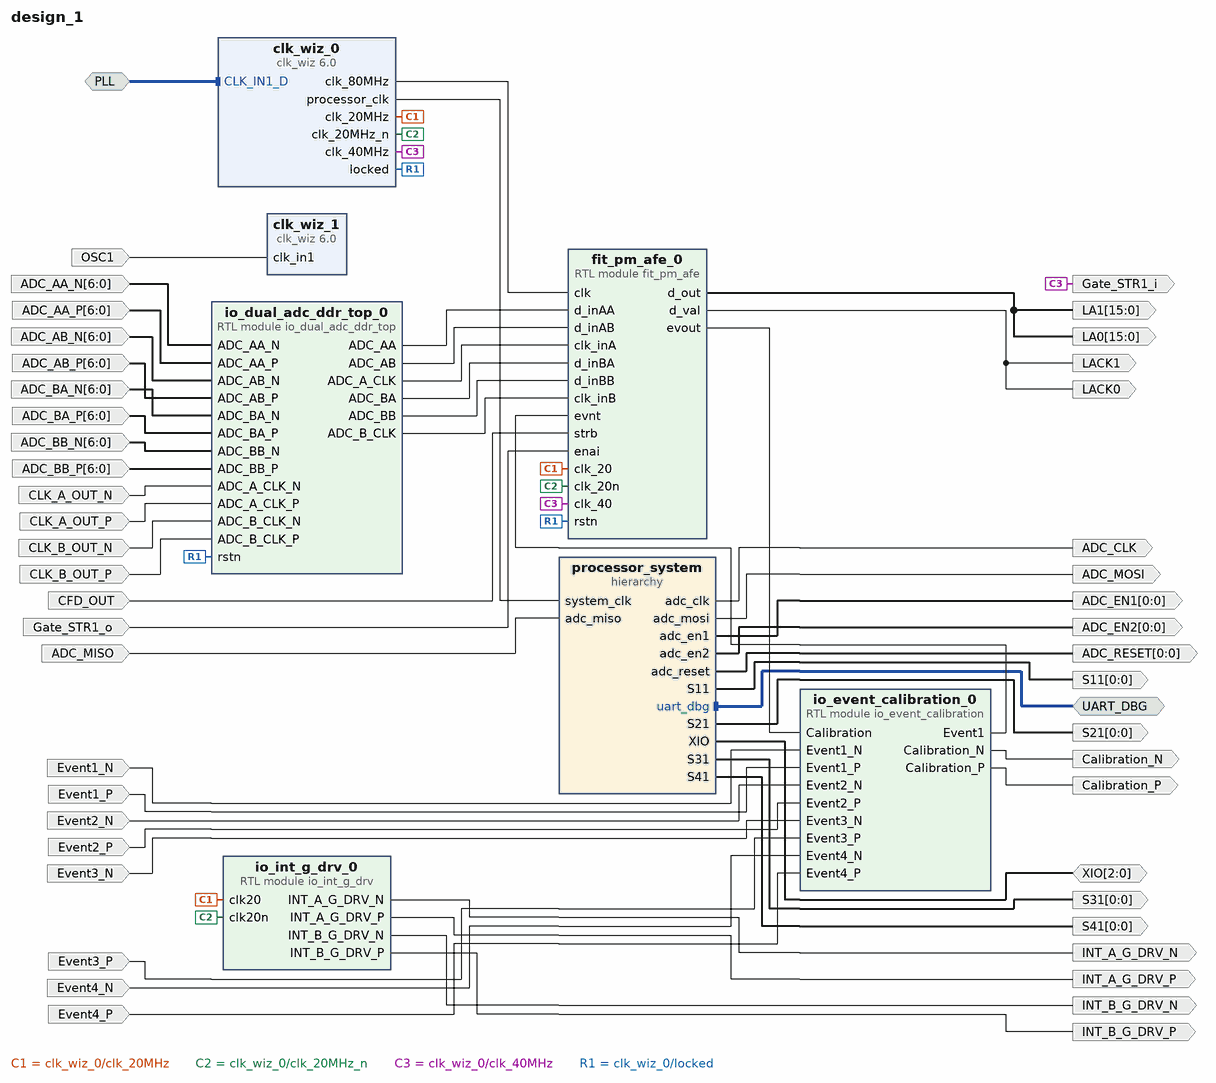
[diagram p0: block diagram of the top level]
# Vivado block design design_1, xcau10p-ffvb676-2-i, Vivado 2024.2
create_bd_design design_1

create_bd_intf_port -mode Master -vlnv xilinx.com:interface:uart_rtl:1.0 UART_DBG
create_bd_intf_port -mode Slave -vlnv xilinx.com:interface:diff_clock_rtl:1.0 PLL
create_bd_port -dir O -from 0 -to 0 S11
create_bd_port -dir O -from 0 -to 0 S21
create_bd_port -dir O -from 0 -to 0 S31
create_bd_port -dir O -from 0 -to 0 S41
create_bd_port -dir IO -from 2 -to 0 XIO
create_bd_port -dir O -from 0 -to 0 ADC_EN1
create_bd_port -dir O -from 0 -to 0 ADC_EN2
create_bd_port -dir O -from 0 -to 0 ADC_RESET
create_bd_port -dir O ADC_CLK
create_bd_port -dir O ADC_MOSI
create_bd_port -dir I ADC_MISO
create_bd_port -dir O Gate_STR1_i
create_bd_port -dir I Gate_STR1_o
create_bd_port -dir I -type clk CLK_A_OUT_N
set_property -dict {CONFIG.FREQ_HZ 240000000} [get_bd_ports CLK_A_OUT_N]
create_bd_port -dir I -type clk CLK_A_OUT_P
set_property -dict {CONFIG.FREQ_HZ 240000000} [get_bd_ports CLK_A_OUT_P]
create_bd_port -dir I -type clk CLK_B_OUT_N
set_property -dict {CONFIG.FREQ_HZ 240000000} [get_bd_ports CLK_B_OUT_N]
create_bd_port -dir I -type clk CLK_B_OUT_P
set_property -dict {CONFIG.FREQ_HZ 240000000} [get_bd_ports CLK_B_OUT_P]
create_bd_port -dir I Event1_N
create_bd_port -dir I Event1_P
create_bd_port -dir I Event2_N
create_bd_port -dir I Event2_P
create_bd_port -dir I Event3_N
create_bd_port -dir I Event3_P
create_bd_port -dir I Event4_N
create_bd_port -dir I Event4_P
create_bd_port -dir O Calibration_P
create_bd_port -dir O Calibration_N
create_bd_port -dir I CFD_OUT
create_bd_port -dir I OSC1
create_bd_port -dir O INT_A_G_DRV_N
create_bd_port -dir O INT_A_G_DRV_P
create_bd_port -dir O INT_B_G_DRV_N
create_bd_port -dir O INT_B_G_DRV_P
create_bd_port -dir O -from 15 -to 0 LA0
create_bd_port -dir O LACK0
create_bd_port -dir O LACK1
create_bd_port -dir O -from 15 -to 0 LA1
create_bd_port -dir I -from 6 -to 0 ADC_AA_N
create_bd_port -dir I -from 6 -to 0 ADC_AA_P
create_bd_port -dir I -from 6 -to 0 ADC_AB_N
create_bd_port -dir I -from 6 -to 0 ADC_AB_P
create_bd_port -dir I -from 6 -to 0 ADC_BA_N
create_bd_port -dir I -from 6 -to 0 ADC_BA_P
create_bd_port -dir I -from 6 -to 0 ADC_BB_N
create_bd_port -dir I -from 6 -to 0 ADC_BB_P

create_bd_cell -type hier processor_system
create_bd_cell -type ip -vlnv xilinx.com:ip:clk_wiz:6.0 clk_wiz_0
set_property -dict [list \
  CONFIG.CLKOUT2_JITTER 139.033 \
  CONFIG.CLKOUT2_PHASE_ERROR 87.180 \
  CONFIG.CLKOUT2_REQUESTED_OUT_FREQ 40.000 \
  CONFIG.CLKOUT2_USED true \
  CONFIG.CLKOUT3_JITTER 162.167 \
  CONFIG.CLKOUT3_PHASE_ERROR 87.180 \
  CONFIG.CLKOUT3_REQUESTED_OUT_FREQ 20.000 \
  CONFIG.CLKOUT3_USED true \
  CONFIG.CLKOUT4_JITTER 162.167 \
  CONFIG.CLKOUT4_PHASE_ERROR 87.180 \
  CONFIG.CLKOUT4_REQUESTED_OUT_FREQ 20.000 \
  CONFIG.CLKOUT4_REQUESTED_PHASE 180.000 \
  CONFIG.CLKOUT4_USED true \
  CONFIG.CLKOUT5_JITTER 120.663 \
  CONFIG.CLKOUT5_PHASE_ERROR 87.180 \
  CONFIG.CLKOUT5_REQUESTED_OUT_FREQ 80.000 \
  CONFIG.CLKOUT5_USED true \
  CONFIG.CLK_OUT1_PORT processor_clk \
  CONFIG.CLK_OUT2_PORT clk_40MHz \
  CONFIG.CLK_OUT3_PORT clk_20MHz \
  CONFIG.CLK_OUT4_PORT clk_20MHz_n \
  CONFIG.CLK_OUT5_PORT clk_80MHz \
  CONFIG.MMCM_CLKIN2_PERIOD 15.000 \
  CONFIG.MMCM_CLKOUT1_DIVIDE 30 \
  CONFIG.MMCM_CLKOUT2_DIVIDE 60 \
  CONFIG.MMCM_CLKOUT3_DIVIDE 60 \
  CONFIG.MMCM_CLKOUT3_PHASE 180.000 \
  CONFIG.MMCM_CLKOUT4_DIVIDE 15 \
  CONFIG.NUM_OUT_CLKS 5 \
  CONFIG.PRIM_SOURCE Differential_clock_capable_pin \
  CONFIG.USE_RESET false \
] [get_bd_cells clk_wiz_0]
create_bd_cell -type module -reference io_event_calibration io_event_calibration_0
create_bd_cell -type module -reference fit_pm_afe fit_pm_afe_0
create_bd_cell -type ip -vlnv xilinx.com:ip:clk_wiz:6.0 clk_wiz_1
set_property -dict [list \
  CONFIG.CLKIN1_JITTER_PS 400.0 \
  CONFIG.CLKOUT1_JITTER 190.517 \
  CONFIG.CLKOUT1_PHASE_ERROR 222.305 \
  CONFIG.CLKOUT1_USED true \
  CONFIG.MMCM_CLKFBOUT_MULT_F 48.000 \
  CONFIG.MMCM_CLKIN1_PERIOD 40.000 \
  CONFIG.MMCM_CLKIN2_PERIOD 10.0 \
  CONFIG.PRIM_IN_FREQ 25.000 \
  CONFIG.USE_LOCKED false \
  CONFIG.USE_RESET false \
] [get_bd_cells clk_wiz_1]
create_bd_cell -type module -reference io_int_g_drv io_int_g_drv_0
create_bd_cell -type module -reference io_dual_adc_ddr_top io_dual_adc_ddr_top_0

# ---- hierarchy /processor_system ----
current_bd_instance /processor_system
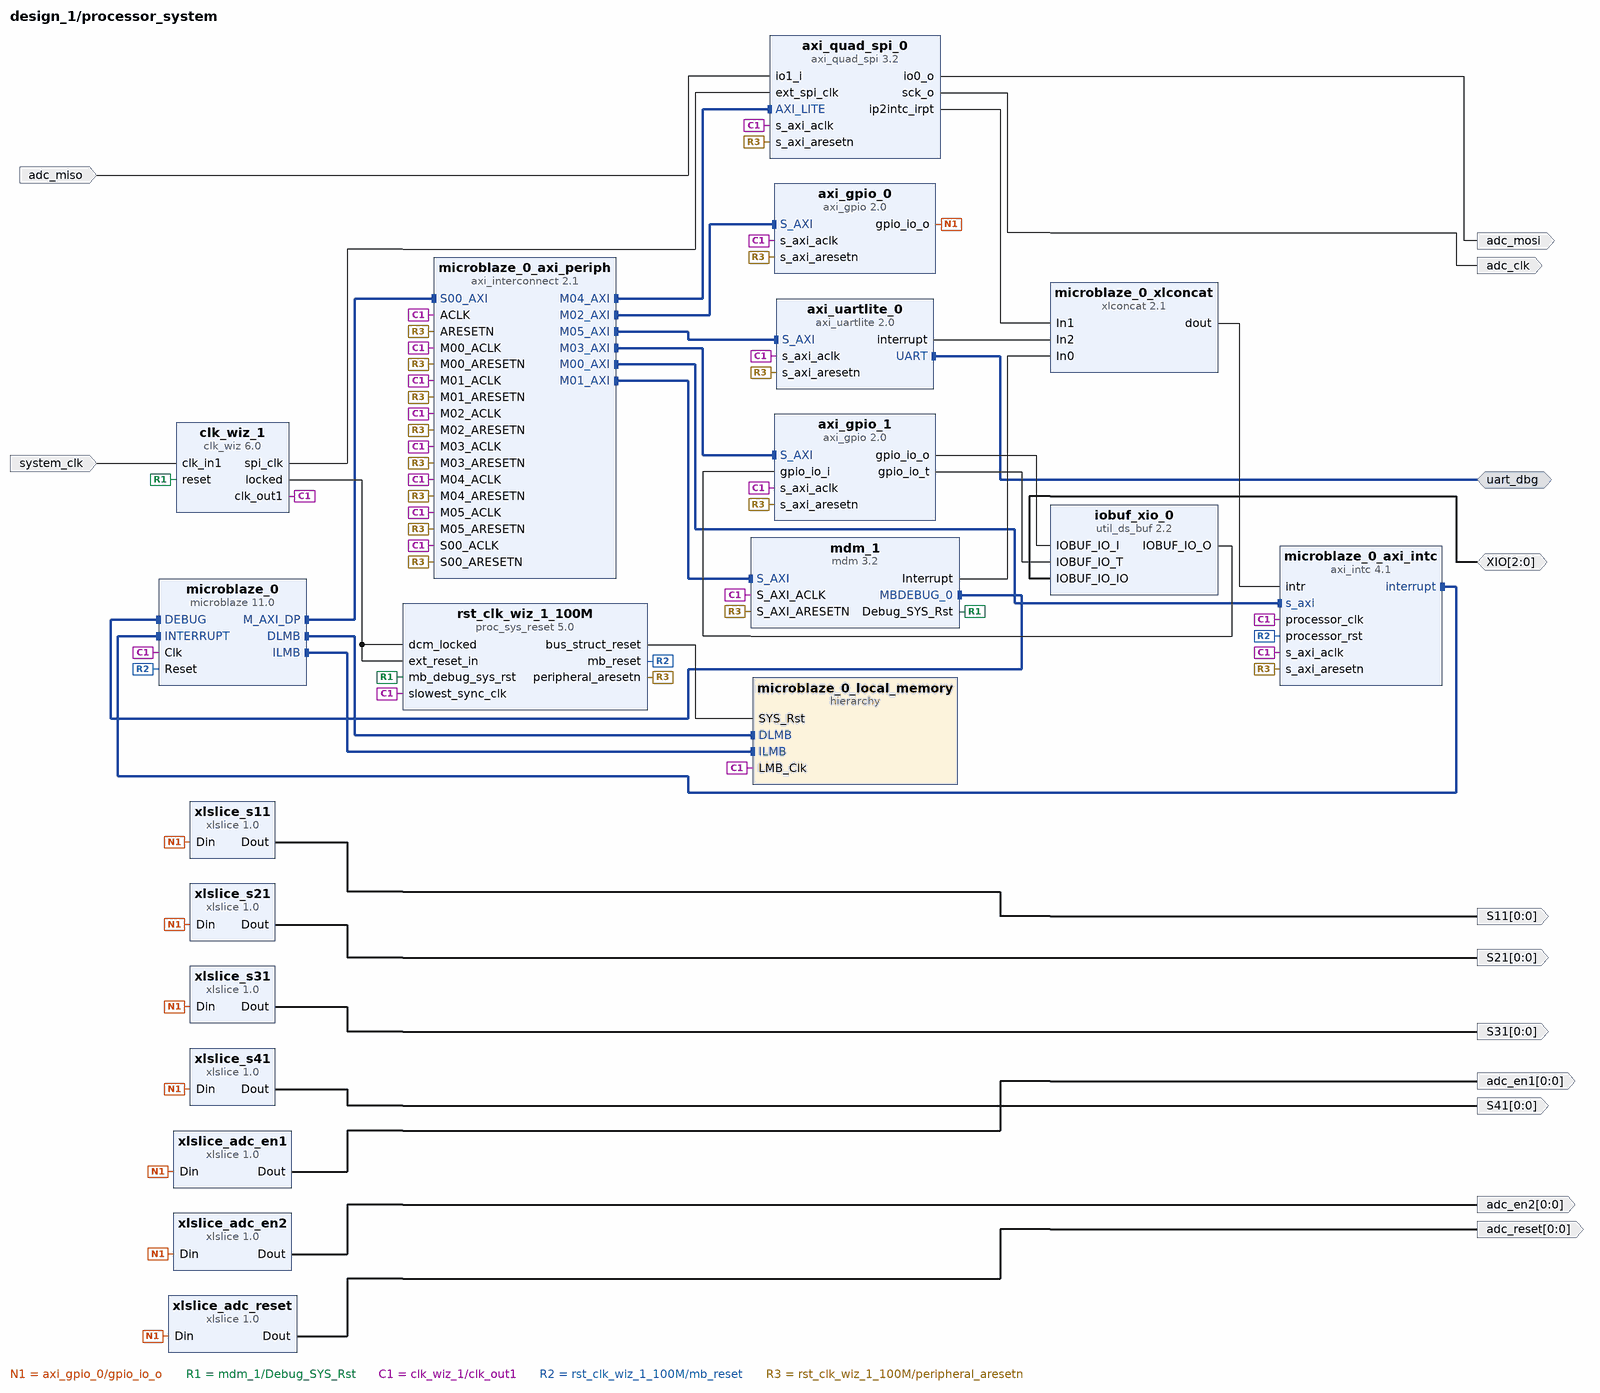
[diagram p1: block diagram inside /processor_system]
create_bd_intf_pin -mode Master -vlnv xilinx.com:interface:uart_rtl:1.0 uart_dbg
create_bd_pin -dir O -from 0 -to 0 S31
create_bd_pin -dir I system_clk
create_bd_pin -dir O adc_mosi
create_bd_pin -dir I adc_miso
create_bd_pin -dir O adc_clk
create_bd_pin -dir O -from 0 -to 0 S41
create_bd_pin -dir O -from 0 -to 0 S11
create_bd_pin -dir O -from 0 -to 0 adc_reset
create_bd_pin -dir O -from 0 -to 0 adc_en1
create_bd_pin -dir IO -from 2 -to 0 XIO
create_bd_pin -dir O -from 0 -to 0 adc_en2
create_bd_pin -dir O -from 0 -to 0 S21

create_bd_cell -type ip -vlnv xilinx.com:ip:xlslice:1.0 xlslice_s31
set_property -dict {CONFIG.DIN_FROM 2 CONFIG.DIN_TO 2 CONFIG.DIN_WIDTH 7} [get_bd_cells xlslice_s31]
create_bd_cell -type ip -vlnv xilinx.com:ip:clk_wiz:6.0 clk_wiz_1
set_property -dict [list \
  CONFIG.CLKOUT2_JITTER 188.586 \
  CONFIG.CLKOUT2_PHASE_ERROR 87.180 \
  CONFIG.CLKOUT2_REQUESTED_OUT_FREQ 10.000 \
  CONFIG.CLKOUT2_USED true \
  CONFIG.CLK_OUT2_PORT spi_clk \
  CONFIG.MMCM_CLKOUT1_DIVIDE 120 \
  CONFIG.NUM_OUT_CLKS 2 \
  CONFIG.PRIM_SOURCE Single_ended_clock_capable_pin \
] [get_bd_cells clk_wiz_1]
create_bd_cell -type ip -vlnv xilinx.com:ip:axi_quad_spi:3.2 axi_quad_spi_0
create_bd_cell -type ip -vlnv xilinx.com:ip:mdm:3.2 mdm_1
set_property -dict {CONFIG.C_ADDR_SIZE 32 CONFIG.C_M_AXI_ADDR_WIDTH 32 CONFIG.C_USE_UART 1} [get_bd_cells mdm_1]
create_bd_cell -type ip -vlnv xilinx.com:ip:xlslice:1.0 xlslice_s41
set_property -dict {CONFIG.DIN_FROM 3 CONFIG.DIN_TO 3 CONFIG.DIN_WIDTH 7} [get_bd_cells xlslice_s41]
create_bd_cell -type ip -vlnv xilinx.com:ip:xlslice:1.0 xlslice_s11
set_property -dict {CONFIG.DIN_WIDTH 7} [get_bd_cells xlslice_s11]
create_bd_cell -type ip -vlnv xilinx.com:ip:axi_gpio:2.0 axi_gpio_0
set_property -dict {CONFIG.C_ALL_OUTPUTS 1 CONFIG.C_GPIO_WIDTH 7} [get_bd_cells axi_gpio_0]
create_bd_cell -type ip -vlnv xilinx.com:ip:axi_uartlite:2.0 axi_uartlite_0
create_bd_cell -type ip -vlnv xilinx.com:ip:axi_gpio:2.0 axi_gpio_1
set_property -dict {CONFIG.C_ALL_OUTPUTS 0 CONFIG.C_GPIO_WIDTH 3} [get_bd_cells axi_gpio_1]
create_bd_cell -type ip -vlnv xilinx.com:ip:xlslice:1.0 xlslice_adc_reset
set_property -dict {CONFIG.DIN_FROM 6 CONFIG.DIN_TO 6 CONFIG.DIN_WIDTH 7} [get_bd_cells xlslice_adc_reset]
create_bd_cell -type ip -vlnv xilinx.com:ip:xlslice:1.0 xlslice_adc_en1
set_property -dict {CONFIG.DIN_FROM 4 CONFIG.DIN_TO 4 CONFIG.DIN_WIDTH 7} [get_bd_cells xlslice_adc_en1]
create_bd_cell -type ip -vlnv xilinx.com:ip:util_ds_buf:2.2 iobuf_xio_0
set_property -dict {CONFIG.C_BUF_TYPE IOBUF CONFIG.C_SIZE 3} [get_bd_cells iobuf_xio_0]
create_bd_cell -type ip -vlnv xilinx.com:ip:xlslice:1.0 xlslice_adc_en2
set_property -dict {CONFIG.DIN_FROM 5 CONFIG.DIN_TO 5 CONFIG.DIN_WIDTH 7} [get_bd_cells xlslice_adc_en2]
create_bd_cell -type ip -vlnv xilinx.com:ip:xlslice:1.0 xlslice_s21
set_property -dict {CONFIG.DIN_FROM 1 CONFIG.DIN_TO 1 CONFIG.DIN_WIDTH 7} [get_bd_cells xlslice_s21]
create_bd_cell -type ip -vlnv xilinx.com:ip:proc_sys_reset:5.0 rst_clk_wiz_1_100M
create_bd_cell -type ip -vlnv xilinx.com:ip:microblaze:11.0 microblaze_0
set_property -dict [list \
  CONFIG.C_DEBUG_ENABLED 1 \
  CONFIG.C_D_AXI 1 \
  CONFIG.C_D_LMB 1 \
  CONFIG.C_ENABLE_CONVERSION 0 \
  CONFIG.C_I_LMB 1 \
  CONFIG.G_TEMPLATE_LIST 8 \
] [get_bd_cells microblaze_0]
create_bd_cell -type ip -vlnv xilinx.com:ip:xlconcat:2.1 microblaze_0_xlconcat
set_property -dict {CONFIG.NUM_PORTS 3} [get_bd_cells microblaze_0_xlconcat]
create_bd_cell -type ip -vlnv xilinx.com:ip:axi_intc:4.1 microblaze_0_axi_intc
set_property -dict {CONFIG.C_HAS_FAST 1} [get_bd_cells microblaze_0_axi_intc]
create_bd_cell -type hier microblaze_0_local_memory
create_bd_cell -type ip -vlnv xilinx.com:ip:axi_interconnect:2.1 microblaze_0_axi_periph
set_property -dict {CONFIG.NUM_MI 6} [get_bd_cells microblaze_0_axi_periph]

# ---- hierarchy /processor_system/microblaze_0_local_memory ----
current_bd_instance /processor_system/microblaze_0_local_memory
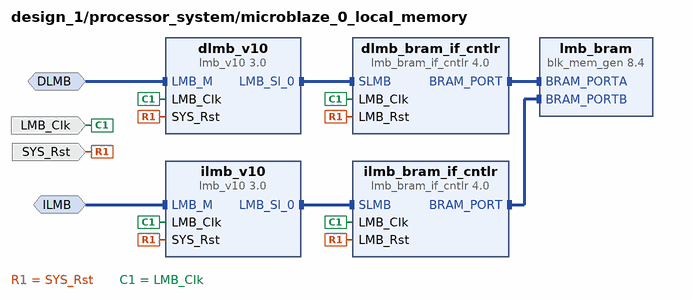
[diagram p2: block diagram inside /processor_system/microblaze_0_local_memory]
create_bd_intf_pin -mode MirroredMaster -vlnv xilinx.com:interface:lmb_rtl:1.0 DLMB
create_bd_intf_pin -mode MirroredMaster -vlnv xilinx.com:interface:lmb_rtl:1.0 ILMB
create_bd_pin -dir I -type clk LMB_Clk
create_bd_pin -dir I -type rst SYS_Rst

create_bd_cell -type ip -vlnv xilinx.com:ip:lmb_v10:3.0 dlmb_v10
create_bd_cell -type ip -vlnv xilinx.com:ip:lmb_v10:3.0 ilmb_v10
create_bd_cell -type ip -vlnv xilinx.com:ip:lmb_bram_if_cntlr:4.0 dlmb_bram_if_cntlr
set_property -dict {CONFIG.C_ECC 0} [get_bd_cells dlmb_bram_if_cntlr]
create_bd_cell -type ip -vlnv xilinx.com:ip:lmb_bram_if_cntlr:4.0 ilmb_bram_if_cntlr
set_property -dict {CONFIG.C_ECC 0} [get_bd_cells ilmb_bram_if_cntlr]
create_bd_cell -type ip -vlnv xilinx.com:ip:blk_mem_gen:8.4 lmb_bram
set_property -dict {CONFIG.Memory_Type True_Dual_Port_RAM CONFIG.use_bram_block BRAM_Controller} [get_bd_cells lmb_bram]

# ---- connections ----

current_bd_instance /processor_system
connect_bd_intf_net [get_bd_intf_pins uart_dbg] [get_bd_intf_pins axi_uartlite_0/UART]
connect_bd_intf_net -intf_net microblaze_0_axi_dp [get_bd_intf_pins microblaze_0_axi_periph/S00_AXI] [get_bd_intf_pins microblaze_0/M_AXI_DP]
connect_bd_intf_net [get_bd_intf_pins microblaze_0_axi_periph/M02_AXI] [get_bd_intf_pins axi_gpio_0/S_AXI]
connect_bd_intf_net [get_bd_intf_pins microblaze_0_axi_periph/M03_AXI] [get_bd_intf_pins axi_gpio_1/S_AXI]
connect_bd_intf_net [get_bd_intf_pins microblaze_0_axi_periph/M04_AXI] [get_bd_intf_pins axi_quad_spi_0/AXI_LITE]
connect_bd_intf_net [get_bd_intf_pins microblaze_0_axi_periph/M05_AXI] [get_bd_intf_pins axi_uartlite_0/S_AXI]
connect_bd_intf_net [get_bd_intf_pins mdm_1/MBDEBUG_0] [get_bd_intf_pins microblaze_0/DEBUG]
connect_bd_intf_net [get_bd_intf_pins microblaze_0/DLMB] [get_bd_intf_pins microblaze_0_local_memory/DLMB]
connect_bd_intf_net [get_bd_intf_pins microblaze_0/ILMB] [get_bd_intf_pins microblaze_0_local_memory/ILMB]
connect_bd_intf_net -intf_net microblaze_0_intc_axi [get_bd_intf_pins microblaze_0_axi_periph/M00_AXI] [get_bd_intf_pins microblaze_0_axi_intc/s_axi]
connect_bd_intf_net [get_bd_intf_pins microblaze_0_axi_intc/interrupt] [get_bd_intf_pins microblaze_0/INTERRUPT]
connect_bd_intf_net -intf_net microblaze_0_mdm_axi [get_bd_intf_pins microblaze_0_axi_periph/M01_AXI] [get_bd_intf_pins mdm_1/S_AXI]
connect_bd_net [get_bd_pins XIO] [get_bd_pins iobuf_xio_0/IOBUF_IO_IO]
connect_bd_net [get_bd_pins adc_miso] [get_bd_pins axi_quad_spi_0/io1_i]
connect_bd_net [get_bd_pins axi_gpio_0/gpio_io_o] \
  [get_bd_pins xlslice_s11/Din] [get_bd_pins xlslice_s21/Din] [get_bd_pins xlslice_s31/Din] [get_bd_pins xlslice_s41/Din] \
  [get_bd_pins xlslice_adc_en1/Din] [get_bd_pins xlslice_adc_en2/Din] [get_bd_pins xlslice_adc_reset/Din]
connect_bd_net [get_bd_pins axi_gpio_1/gpio_io_o] [get_bd_pins iobuf_xio_0/IOBUF_IO_I]
connect_bd_net [get_bd_pins axi_gpio_1/gpio_io_t] [get_bd_pins iobuf_xio_0/IOBUF_IO_T]
connect_bd_net [get_bd_pins axi_quad_spi_0/io0_o] [get_bd_pins adc_mosi]
connect_bd_net [get_bd_pins axi_quad_spi_0/ip2intc_irpt] [get_bd_pins microblaze_0_xlconcat/In1]
connect_bd_net [get_bd_pins axi_quad_spi_0/sck_o] [get_bd_pins adc_clk]
connect_bd_net [get_bd_pins axi_uartlite_0/interrupt] [get_bd_pins microblaze_0_xlconcat/In2]
connect_bd_net [get_bd_pins clk_wiz_1/locked] [get_bd_pins rst_clk_wiz_1_100M/dcm_locked] [get_bd_pins rst_clk_wiz_1_100M/ext_reset_in]
connect_bd_net [get_bd_pins clk_wiz_1/spi_clk] [get_bd_pins axi_quad_spi_0/ext_spi_clk]
connect_bd_net [get_bd_pins mdm_1/Interrupt] [get_bd_pins microblaze_0_xlconcat/In0]
connect_bd_net [get_bd_pins mdm_1/Debug_SYS_Rst] [get_bd_pins rst_clk_wiz_1_100M/mb_debug_sys_rst] [get_bd_pins clk_wiz_1/reset]
connect_bd_net -net microblaze_0_Clk [get_bd_pins clk_wiz_1/clk_out1] \
  [get_bd_pins microblaze_0/Clk] [get_bd_pins microblaze_0_axi_periph/ACLK] [get_bd_pins microblaze_0_axi_periph/S00_ACLK] \
  [get_bd_pins microblaze_0_axi_periph/M00_ACLK] [get_bd_pins microblaze_0_axi_periph/M01_ACLK] \
  [get_bd_pins microblaze_0_axi_intc/s_axi_aclk] [get_bd_pins microblaze_0_axi_intc/processor_clk] \
  [get_bd_pins microblaze_0_local_memory/LMB_Clk] [get_bd_pins mdm_1/S_AXI_ACLK] \
  [get_bd_pins rst_clk_wiz_1_100M/slowest_sync_clk] [get_bd_pins axi_gpio_0/s_axi_aclk] \
  [get_bd_pins microblaze_0_axi_periph/M02_ACLK] [get_bd_pins axi_gpio_1/s_axi_aclk] \
  [get_bd_pins microblaze_0_axi_periph/M03_ACLK] [get_bd_pins axi_quad_spi_0/s_axi_aclk] \
  [get_bd_pins microblaze_0_axi_periph/M04_ACLK] [get_bd_pins axi_uartlite_0/s_axi_aclk] \
  [get_bd_pins microblaze_0_axi_periph/M05_ACLK]
connect_bd_net -net microblaze_0_intr [get_bd_pins microblaze_0_xlconcat/dout] [get_bd_pins microblaze_0_axi_intc/intr]
connect_bd_net [get_bd_pins rst_clk_wiz_1_100M/bus_struct_reset] [get_bd_pins microblaze_0_local_memory/SYS_Rst]
connect_bd_net [get_bd_pins rst_clk_wiz_1_100M/mb_reset] [get_bd_pins microblaze_0/Reset] [get_bd_pins microblaze_0_axi_intc/processor_rst]
connect_bd_net [get_bd_pins rst_clk_wiz_1_100M/peripheral_aresetn] \
  [get_bd_pins microblaze_0_axi_periph/ARESETN] [get_bd_pins microblaze_0_axi_periph/S00_ARESETN] \
  [get_bd_pins microblaze_0_axi_periph/M00_ARESETN] [get_bd_pins microblaze_0_axi_periph/M01_ARESETN] \
  [get_bd_pins mdm_1/S_AXI_ARESETN] [get_bd_pins microblaze_0_axi_intc/s_axi_aresetn] [get_bd_pins axi_gpio_0/s_axi_aresetn] \
  [get_bd_pins microblaze_0_axi_periph/M02_ARESETN] [get_bd_pins axi_gpio_1/s_axi_aresetn] \
  [get_bd_pins microblaze_0_axi_periph/M03_ARESETN] [get_bd_pins axi_quad_spi_0/s_axi_aresetn] \
  [get_bd_pins microblaze_0_axi_periph/M04_ARESETN] [get_bd_pins axi_uartlite_0/s_axi_aresetn] \
  [get_bd_pins microblaze_0_axi_periph/M05_ARESETN]
connect_bd_net [get_bd_pins system_clk] [get_bd_pins clk_wiz_1/clk_in1]
connect_bd_net -net util_ds_buf_0_IOBUF_IO_O [get_bd_pins iobuf_xio_0/IOBUF_IO_O] [get_bd_pins axi_gpio_1/gpio_io_i]
connect_bd_net -net xlslice_0_Dout [get_bd_pins xlslice_s11/Dout] [get_bd_pins S11]
connect_bd_net -net xlslice_1_Dout [get_bd_pins xlslice_s21/Dout] [get_bd_pins S21]
connect_bd_net -net xlslice_2_Dout [get_bd_pins xlslice_s31/Dout] [get_bd_pins S31]
connect_bd_net -net xlslice_3_Dout [get_bd_pins xlslice_s41/Dout] [get_bd_pins S41]
connect_bd_net [get_bd_pins xlslice_adc_en1/Dout] [get_bd_pins adc_en1]
connect_bd_net [get_bd_pins xlslice_adc_en2/Dout] [get_bd_pins adc_en2]
connect_bd_net [get_bd_pins xlslice_adc_reset/Dout] [get_bd_pins adc_reset]
set_property HDL_ATTRIBUTE.BMM_INFO_PROCESSOR {microblaze-le > design_1 processor_system/microblaze_0_local_memory/dlmb_bram_if_cntlr} [get_bd_cells microblaze_0]
set_property HDL_ATTRIBUTE.KEEP_HIERARCHY yes [get_bd_cells microblaze_0]

current_bd_instance /processor_system/microblaze_0_local_memory
connect_bd_intf_net -intf_net microblaze_0_dlmb [get_bd_intf_pins dlmb_v10/LMB_M] [get_bd_intf_pins DLMB]
connect_bd_intf_net -intf_net microblaze_0_dlmb_bus [get_bd_intf_pins dlmb_v10/LMB_Sl_0] [get_bd_intf_pins dlmb_bram_if_cntlr/SLMB]
connect_bd_intf_net -intf_net microblaze_0_dlmb_cntlr [get_bd_intf_pins dlmb_bram_if_cntlr/BRAM_PORT] [get_bd_intf_pins lmb_bram/BRAM_PORTA]
connect_bd_intf_net -intf_net microblaze_0_ilmb [get_bd_intf_pins ilmb_v10/LMB_M] [get_bd_intf_pins ILMB]
connect_bd_intf_net -intf_net microblaze_0_ilmb_bus [get_bd_intf_pins ilmb_v10/LMB_Sl_0] [get_bd_intf_pins ilmb_bram_if_cntlr/SLMB]
connect_bd_intf_net -intf_net microblaze_0_ilmb_cntlr [get_bd_intf_pins ilmb_bram_if_cntlr/BRAM_PORT] [get_bd_intf_pins lmb_bram/BRAM_PORTB]
connect_bd_net [get_bd_pins SYS_Rst] \
  [get_bd_pins dlmb_v10/SYS_Rst] [get_bd_pins dlmb_bram_if_cntlr/LMB_Rst] [get_bd_pins ilmb_v10/SYS_Rst] \
  [get_bd_pins ilmb_bram_if_cntlr/LMB_Rst]
connect_bd_net -net microblaze_0_Clk [get_bd_pins LMB_Clk] \
  [get_bd_pins dlmb_v10/LMB_Clk] [get_bd_pins dlmb_bram_if_cntlr/LMB_Clk] [get_bd_pins ilmb_v10/LMB_Clk] \
  [get_bd_pins ilmb_bram_if_cntlr/LMB_Clk]
set_property HDL_ATTRIBUTE.BMM_INFO_ADDRESS_SPACE {byte  0x00000000 32 > design_1 processor_system/microblaze_0_local_memory/lmb_bram} [get_bd_cells dlmb_bram_if_cntlr]
set_property HDL_ATTRIBUTE.KEEP_HIERARCHY yes [get_bd_cells dlmb_bram_if_cntlr]

current_bd_instance /
connect_bd_intf_net -intf_net CLK_IN1_D_0_1 [get_bd_intf_ports PLL] [get_bd_intf_pins clk_wiz_0/CLK_IN1_D]
connect_bd_intf_net -intf_net axi_uartlite_0_UART [get_bd_intf_ports UART_DBG] [get_bd_intf_pins processor_system/uart_dbg]
connect_bd_net -net ADC_AA_N_0_1 [get_bd_ports ADC_AA_N] [get_bd_pins io_dual_adc_ddr_top_0/ADC_AA_N]
connect_bd_net -net ADC_AA_P_0_1 [get_bd_ports ADC_AA_P] [get_bd_pins io_dual_adc_ddr_top_0/ADC_AA_P]
connect_bd_net -net ADC_AB_N_0_1 [get_bd_ports ADC_AB_N] [get_bd_pins io_dual_adc_ddr_top_0/ADC_AB_N]
connect_bd_net -net ADC_AB_P_0_1 [get_bd_ports ADC_AB_P] [get_bd_pins io_dual_adc_ddr_top_0/ADC_AB_P]
connect_bd_net -net ADC_BA_N_0_1 [get_bd_ports ADC_BA_N] [get_bd_pins io_dual_adc_ddr_top_0/ADC_BA_N]
connect_bd_net -net ADC_BA_P_0_1 [get_bd_ports ADC_BA_P] [get_bd_pins io_dual_adc_ddr_top_0/ADC_BA_P]
connect_bd_net -net ADC_BB_N_0_1 [get_bd_ports ADC_BB_N] [get_bd_pins io_dual_adc_ddr_top_0/ADC_BB_N]
connect_bd_net -net ADC_BB_P_0_1 [get_bd_ports ADC_BB_P] [get_bd_pins io_dual_adc_ddr_top_0/ADC_BB_P]
connect_bd_net [get_bd_ports CFD_OUT] [get_bd_pins fit_pm_afe_0/strb]
connect_bd_net -net CLKA_OUT_N_1 [get_bd_ports CLK_A_OUT_N] [get_bd_pins io_dual_adc_ddr_top_0/ADC_A_CLK_N]
connect_bd_net -net CLKA_OUT_P_1 [get_bd_ports CLK_A_OUT_P] [get_bd_pins io_dual_adc_ddr_top_0/ADC_A_CLK_P]
connect_bd_net -net CLKB_OUT_N_1 [get_bd_ports CLK_B_OUT_N] [get_bd_pins io_dual_adc_ddr_top_0/ADC_B_CLK_N]
connect_bd_net -net CLKB_OUT_P_1 [get_bd_ports CLK_B_OUT_P] [get_bd_pins io_dual_adc_ddr_top_0/ADC_B_CLK_P]
connect_bd_net -net Event1_N_0_1 [get_bd_ports Event1_N] [get_bd_pins io_event_calibration_0/Event1_N]
connect_bd_net -net Event1_P_0_1 [get_bd_ports Event1_P] [get_bd_pins io_event_calibration_0/Event1_P]
connect_bd_net -net Event2_N_0_1 [get_bd_ports Event2_N] [get_bd_pins io_event_calibration_0/Event2_N]
connect_bd_net -net Event2_P_0_1 [get_bd_ports Event2_P] [get_bd_pins io_event_calibration_0/Event2_P]
connect_bd_net -net Event3_N_0_1 [get_bd_ports Event3_N] [get_bd_pins io_event_calibration_0/Event3_N]
connect_bd_net -net Event3_P_0_1 [get_bd_ports Event3_P] [get_bd_pins io_event_calibration_0/Event3_P]
connect_bd_net -net Event4_N_0_1 [get_bd_ports Event4_N] [get_bd_pins io_event_calibration_0/Event4_N]
connect_bd_net -net Event4_P_0_1 [get_bd_ports Event4_P] [get_bd_pins io_event_calibration_0/Event4_P]
connect_bd_net [get_bd_ports Gate_STR1_o] [get_bd_pins fit_pm_afe_0/enai]
connect_bd_net [get_bd_ports XIO] [get_bd_pins processor_system/XIO]
connect_bd_net -net OSC1_1 [get_bd_ports OSC1] [get_bd_pins clk_wiz_1/clk_in1]
connect_bd_net [get_bd_ports ADC_MISO] [get_bd_pins processor_system/adc_miso]
connect_bd_net -net axi_quad_spi_0_io0_o [get_bd_pins processor_system/adc_mosi] [get_bd_ports ADC_MOSI]
connect_bd_net -net axi_quad_spi_0_sck_o [get_bd_pins processor_system/adc_clk] [get_bd_ports ADC_CLK]
connect_bd_net [get_bd_pins clk_wiz_0/clk_20MHz] [get_bd_pins io_int_g_drv_0/clk20] [get_bd_pins fit_pm_afe_0/clk_20]
connect_bd_net [get_bd_pins clk_wiz_0/clk_20MHz_n] [get_bd_pins io_int_g_drv_0/clk20n] [get_bd_pins fit_pm_afe_0/clk_20n]
connect_bd_net [get_bd_pins clk_wiz_0/clk_40MHz] [get_bd_ports Gate_STR1_i] [get_bd_pins fit_pm_afe_0/clk_40]
connect_bd_net [get_bd_pins clk_wiz_0/clk_80MHz] [get_bd_pins fit_pm_afe_0/clk]
connect_bd_net [get_bd_pins clk_wiz_0/locked] [get_bd_pins fit_pm_afe_0/rstn] [get_bd_pins io_dual_adc_ddr_top_0/rstn]
connect_bd_net [get_bd_pins clk_wiz_0/processor_clk] [get_bd_pins processor_system/system_clk]
connect_bd_net [get_bd_pins fit_pm_afe_0/d_out] [get_bd_ports LA0] [get_bd_ports LA1]
connect_bd_net [get_bd_pins fit_pm_afe_0/d_val] [get_bd_ports LACK0] [get_bd_ports LACK1]
connect_bd_net [get_bd_pins fit_pm_afe_0/evout] [get_bd_pins io_event_calibration_0/Calibration]
connect_bd_net [get_bd_pins io_dual_adc_ddr_top_0/ADC_AA] [get_bd_pins fit_pm_afe_0/d_inAA]
connect_bd_net [get_bd_pins io_dual_adc_ddr_top_0/ADC_AB] [get_bd_pins fit_pm_afe_0/d_inAB]
connect_bd_net [get_bd_pins io_dual_adc_ddr_top_0/ADC_A_CLK] [get_bd_pins fit_pm_afe_0/clk_inA]
connect_bd_net [get_bd_pins io_dual_adc_ddr_top_0/ADC_BA] [get_bd_pins fit_pm_afe_0/d_inBA]
connect_bd_net [get_bd_pins io_dual_adc_ddr_top_0/ADC_BB] [get_bd_pins fit_pm_afe_0/d_inBB]
connect_bd_net [get_bd_pins io_dual_adc_ddr_top_0/ADC_B_CLK] [get_bd_pins fit_pm_afe_0/clk_inB]
connect_bd_net [get_bd_pins io_event_calibration_0/Calibration_N] [get_bd_ports Calibration_N]
connect_bd_net [get_bd_pins io_event_calibration_0/Calibration_P] [get_bd_ports Calibration_P]
connect_bd_net [get_bd_pins io_event_calibration_0/Event1] [get_bd_pins fit_pm_afe_0/evnt]
connect_bd_net [get_bd_pins io_int_g_drv_0/INT_A_G_DRV_N] [get_bd_ports INT_A_G_DRV_N]
connect_bd_net [get_bd_pins io_int_g_drv_0/INT_A_G_DRV_P] [get_bd_ports INT_A_G_DRV_P]
connect_bd_net [get_bd_pins io_int_g_drv_0/INT_B_G_DRV_N] [get_bd_ports INT_B_G_DRV_N]
connect_bd_net [get_bd_pins io_int_g_drv_0/INT_B_G_DRV_P] [get_bd_ports INT_B_G_DRV_P]
connect_bd_net -net xlslice_0_Dout [get_bd_pins processor_system/S11] [get_bd_ports S11]
connect_bd_net -net xlslice_1_Dout [get_bd_pins processor_system/S21] [get_bd_ports S21]
connect_bd_net -net xlslice_2_Dout [get_bd_pins processor_system/S31] [get_bd_ports S31]
connect_bd_net -net xlslice_3_Dout [get_bd_pins processor_system/S41] [get_bd_ports S41]
connect_bd_net -net xlslice_adc_en1_Dout [get_bd_pins processor_system/adc_en1] [get_bd_ports ADC_EN1]
connect_bd_net -net xlslice_adc_en2_Dout [get_bd_pins processor_system/adc_en2] [get_bd_ports ADC_EN2]
connect_bd_net -net xlslice_adc_reset_Dout [get_bd_pins processor_system/adc_reset] [get_bd_ports ADC_RESET]

# ---- address map ----
assign_bd_address -offset 0x00000000 -range 64K -target_address_space [get_bd_addr_spaces processor_system/microblaze_0/Data] [get_bd_addr_segs processor_system/microblaze_0_local_memory/dlmb_bram_if_cntlr/SLMB/Mem]
assign_bd_address -offset 0x40000000 -range 64K -target_address_space [get_bd_addr_spaces processor_system/microblaze_0/Data] [get_bd_addr_segs processor_system/axi_gpio_0/S_AXI/Reg]
assign_bd_address -offset 0x40010000 -range 64K -target_address_space [get_bd_addr_spaces processor_system/microblaze_0/Data] [get_bd_addr_segs processor_system/axi_gpio_1/S_AXI/Reg]
assign_bd_address -offset 0x40600000 -range 64K -target_address_space [get_bd_addr_spaces processor_system/microblaze_0/Data] [get_bd_addr_segs processor_system/axi_uartlite_0/S_AXI/Reg]
assign_bd_address -offset 0x41200000 -range 64K -target_address_space [get_bd_addr_spaces processor_system/microblaze_0/Data] [get_bd_addr_segs processor_system/microblaze_0_axi_intc/S_AXI/Reg]
assign_bd_address -offset 0x41400000 -range 4K -target_address_space [get_bd_addr_spaces processor_system/microblaze_0/Data] [get_bd_addr_segs processor_system/mdm_1/S_AXI/Reg]
assign_bd_address -offset 0x44A00000 -range 64K -target_address_space [get_bd_addr_spaces processor_system/microblaze_0/Data] [get_bd_addr_segs processor_system/axi_quad_spi_0/AXI_LITE/Reg]
assign_bd_address -offset 0x00000000 -range 64K -target_address_space [get_bd_addr_spaces processor_system/microblaze_0/Instruction] [get_bd_addr_segs processor_system/microblaze_0_local_memory/ilmb_bram_if_cntlr/SLMB/Mem]

validate_bd_design
save_bd_design
